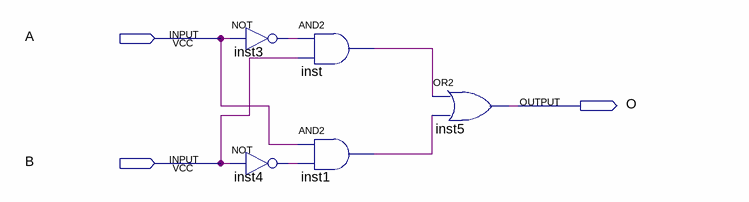
[diagram p0: schematic sheet]
// Quartus schematic HalfAdderCLA.bdf as structural Verilog: 5 symbols, 3 pins
module HalfAdderCLA (
  input  A,
  input  B,
  output O
);

  wire inst1_out, inst3_out, inst4_out, inst_out;

  not inst3 (inst3_out, A);
  not inst4 (inst4_out, B);
  and inst (inst_out, inst3_out, B);
  and inst1 (inst1_out, A, inst4_out);
  or inst5 (O, inst_out, inst1_out);
endmodule
